# EAGLE schematic example_rfm (EAGLE 6.6.0)
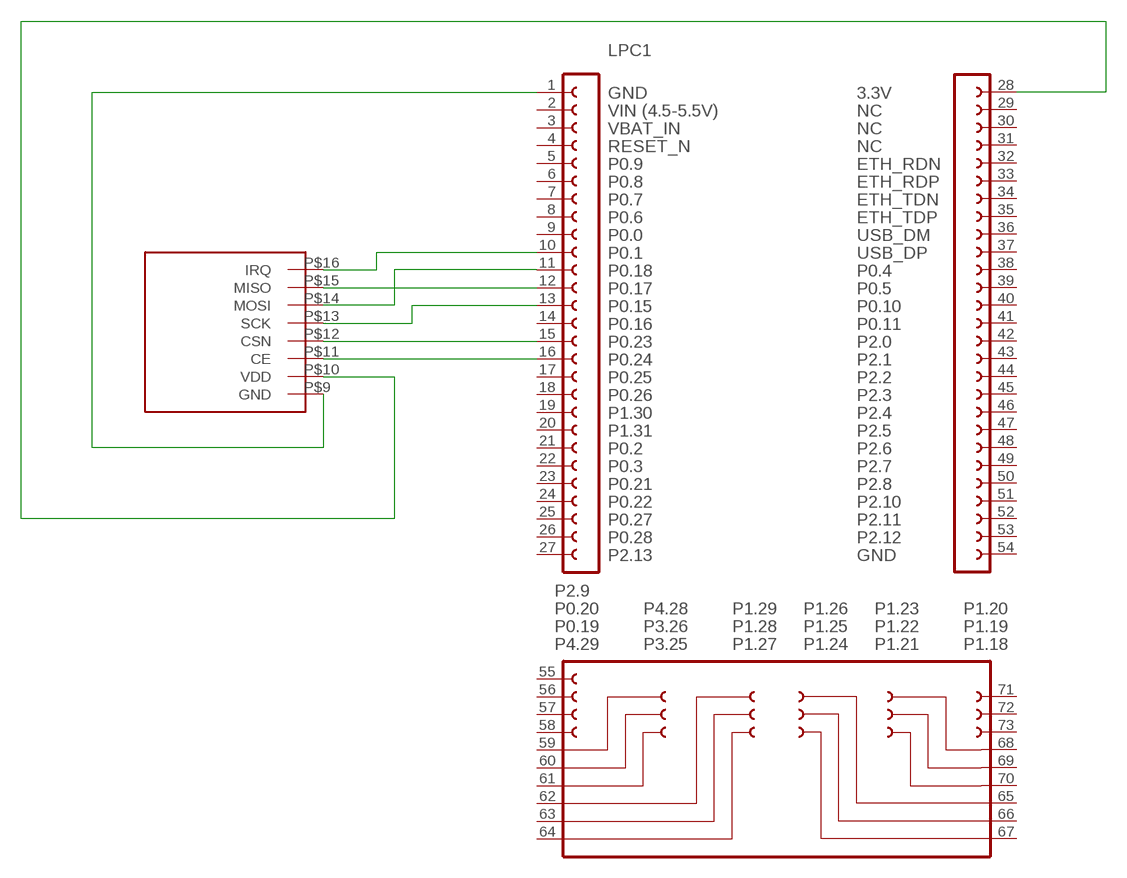
[diagram p0: schematic, sheet 1]

## Parts
LPC1  LPCXPRESSO_LPC1769  [LPCXPRESSO_LPC1769]
U$1  RFM73/70_DIP  [RFM73_DIP]

## Nets
GND: LPC1.1 U$1.P$9(GND)
N$1: LPC1.11 U$1.P$14(MOSI)
N$2: LPC1.12 U$1.P$15(MISO)
N$3: LPC1.13 U$1.P$13(SCK)
N$4: LPC1.15 U$1.P$12(CSN)
N$5: LPC1.16 U$1.P$11(CE)
N$6: LPC1.10 U$1.P$16(IRQ)
VDD: LPC1.28 U$1.P$10(VDD)
Unconnected: LPC1.2 LPC1.3 LPC1.4 LPC1.5 LPC1.6 LPC1.7 LPC1.8 LPC1.9 LPC1.14 LPC1.17 LPC1.18 LPC1.19 LPC1.20 LPC1.21 LPC1.22 LPC1.23 LPC1.24 LPC1.25 LPC1.26 LPC1.27 LPC1.29 LPC1.30 LPC1.31 LPC1.32 LPC1.33 LPC1.34 LPC1.35 LPC1.36 LPC1.37 LPC1.38 LPC1.39 LPC1.40 LPC1.41 LPC1.42 LPC1.43 LPC1.44 LPC1.45 LPC1.46 LPC1.47 LPC1.48 LPC1.49 LPC1.50 LPC1.51 LPC1.52 LPC1.53 LPC1.54 LPC1.55 LPC1.56 LPC1.57 LPC1.58 LPC1.59 LPC1.60 LPC1.61 LPC1.62 LPC1.63 LPC1.64 LPC1.65 LPC1.66 LPC1.67 LPC1.68 LPC1.69 LPC1.70 LPC1.71 LPC1.72 LPC1.73

## Library data of the parts
LPC1 = lpc:LPCXPRESSO_LPC1769
U$1 = rfm:RFM73/70_DIP